# Altium project esp32_motor_driver.PrjPcb
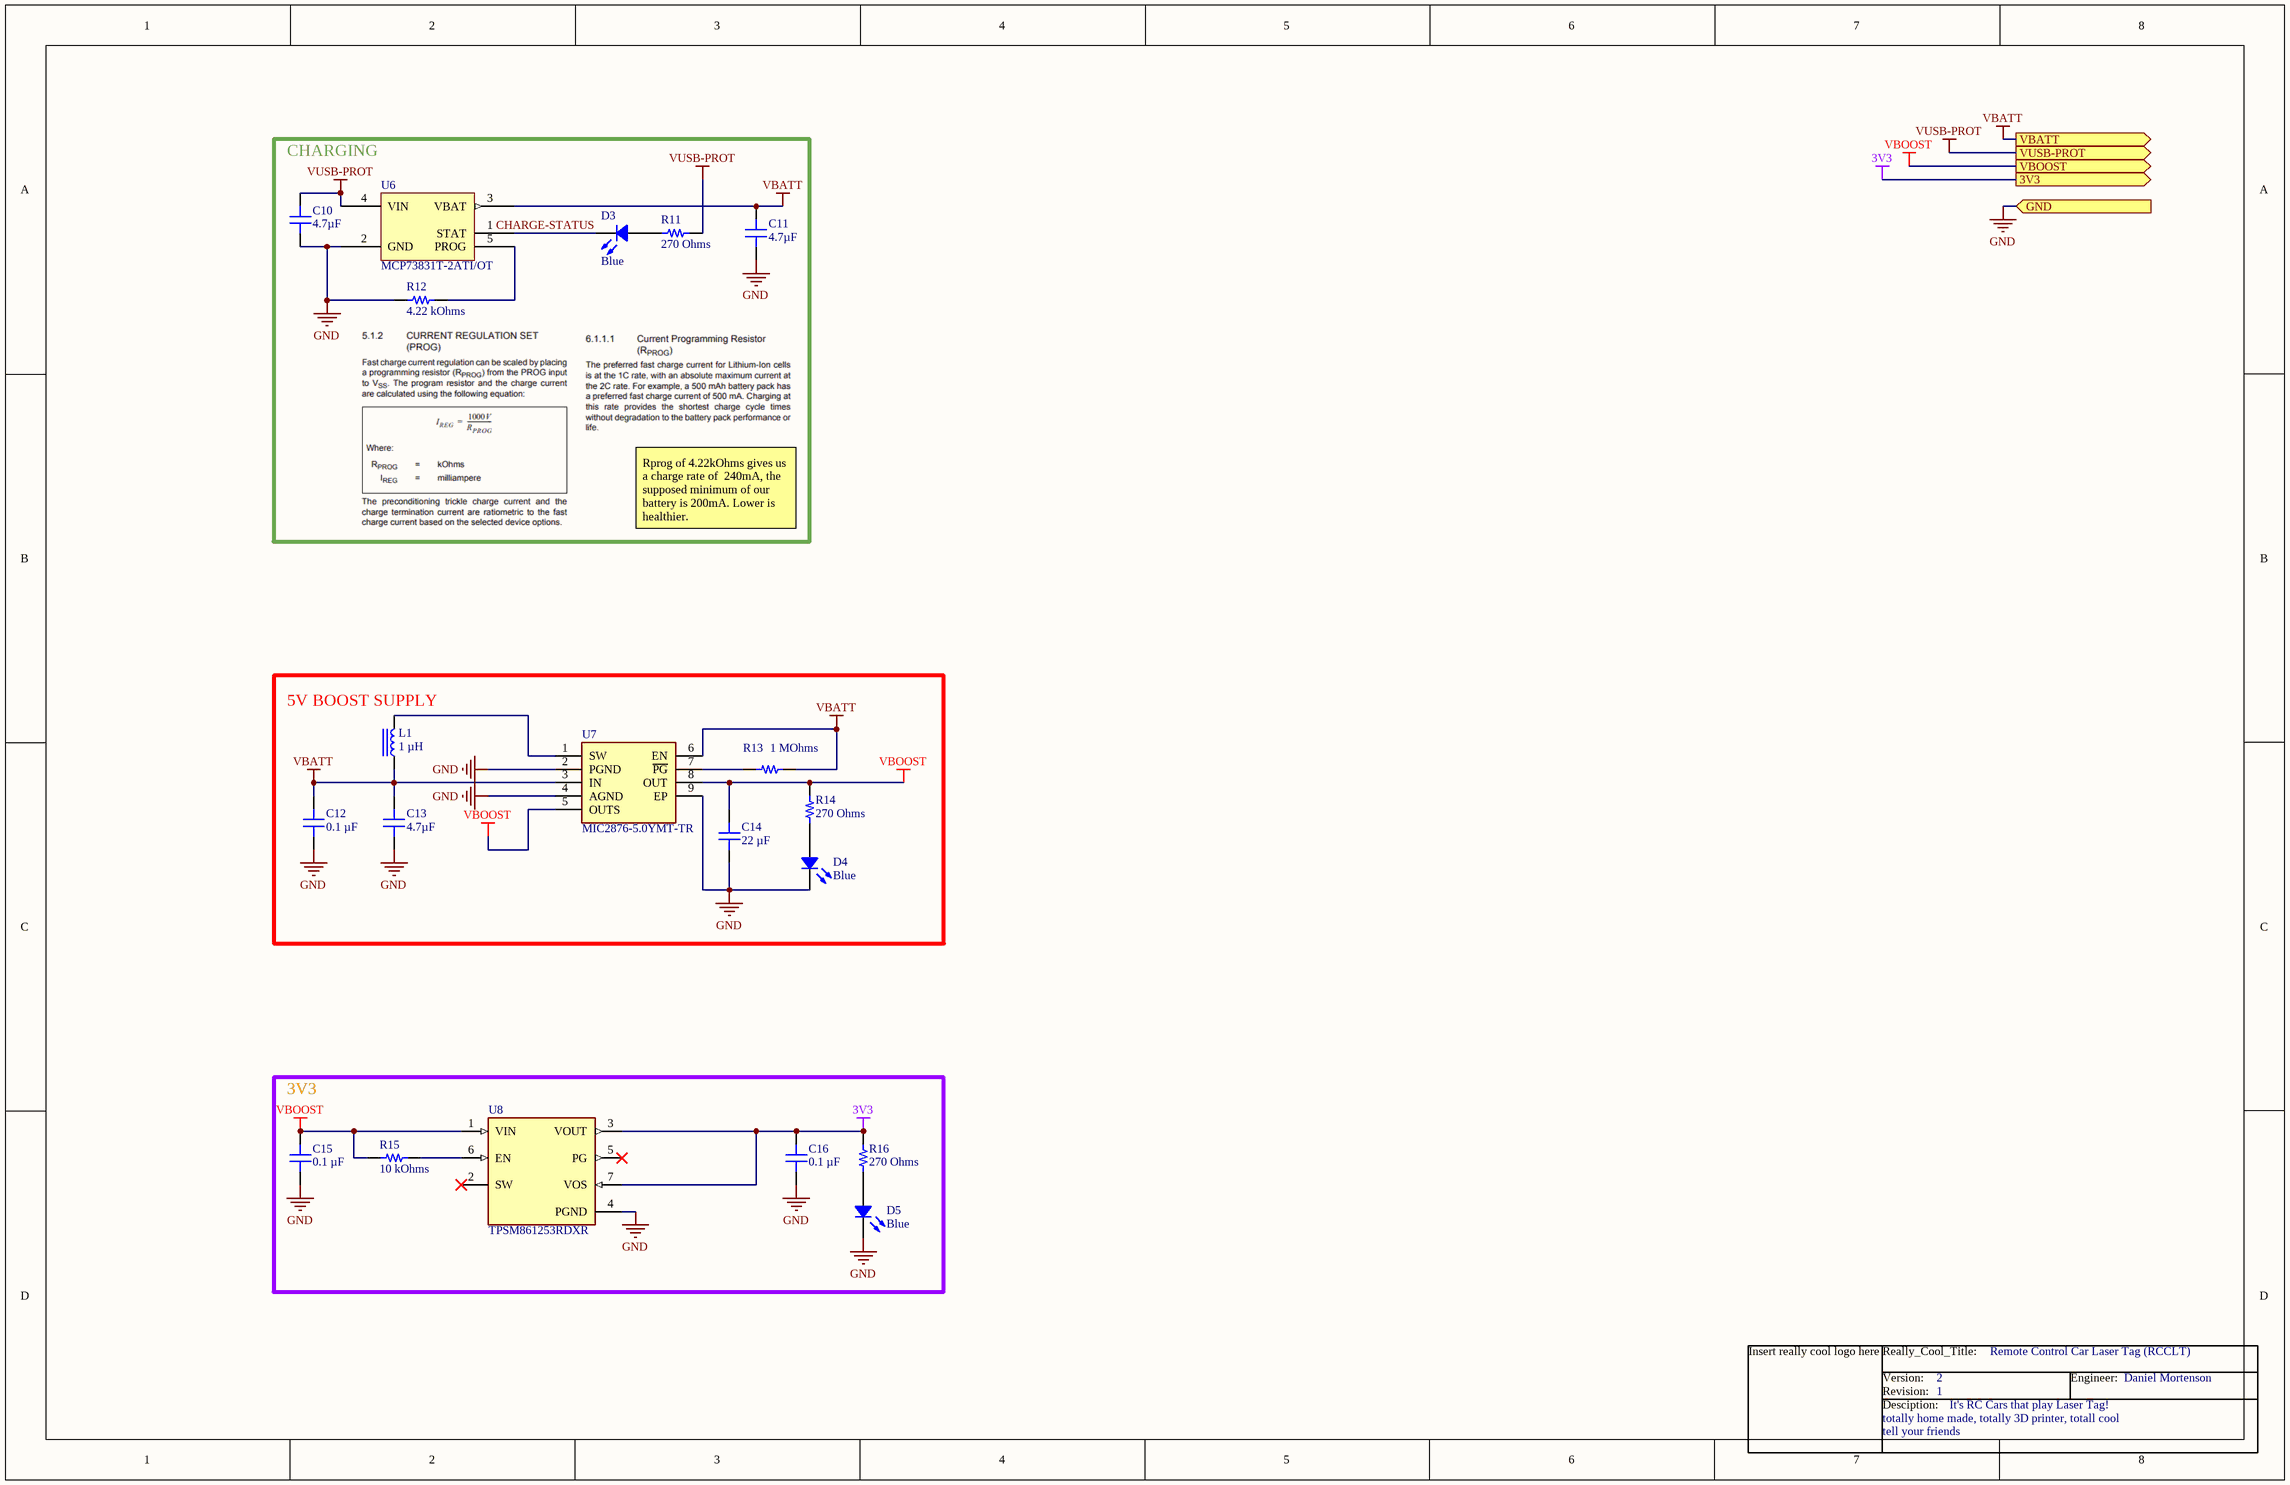
[diagram p0: Power_Supply.SchDoc]
Description1: It's RC Cars that play Laser Tag!; Description2: totally home made, totally 3D printer, totall cool; Description3: tell your friends; Engineer: Daniel Mortenson; Really_Cool_Title: Remote Control Car Laser Tag (RCCLT); Revision: 1; Version: 2
1 sheet, 20 parts. Net scope: flat (ports and power ports of the same name join across sheets).
Board file: RCCLTV2.PcbDoc

## Sheet Power_Supply.SchDoc
size Tabloid; SheetNumber: 3; SheetTotal: 4

### Parts
C10  4.7µF  [CAP 0805_2012]
C11  4.7µF  [CAP 0805_2012]
C12  0.1 µF  [CAP 0805_2012]
C13  4.7µF  [CAP 0805_2012]
C14  22 µF  [CAP 0805_2012]
C15  0.1 µF  [CAP 0805_2012]
C16  0.1 µF  [CAP 0805_2012]
D3  Blue  [LED 0805_2012 BLUE]
D4  Blue  [LED 0805_2012 BLUE]
D5  Blue  [LED 0805_2012 BLUE]
L1  1 µH  [TAIYO YUDEN MAMK2520T1R0M]
R11  270 Ohms  [RES 0805_2012]
R12  4.22 kOhms  [RES 0805_2012]
R13  1 MOhms  [RES 0805_2012]
R14  270 Ohms  [RES 0805_2012]
R15  10 kOhms  [RES 0805_2012]
R16  270 Ohms  [RES 0805_2012]
U6  MCP73831T-2ATI/OT  [MICROCHIP SOT-23-5 OT]
U7  MIC2876-5.0YMT-TR  [MIC287650YMTTR]
U8  TPSM861253RDXR  [VREG_TPSM861253RDXR]

### Blocks framed on the sheet
CHARGING: C10 C11 D3 R11 R12 U6
5V BOOST SUPPLY: C12-C14 D4 L1 R13 R14 U7
3V3: C15 C16 D5 R15 R16 U8

### Ports
3V3 (out), GND (in), VBATT (out), VBOOST (out), VUSB-PROT (out)

### Nets
3V3: C16.2 R16.1 U8.3(VOUT) U8.7(VOS) ; port 3V3
GND: C10.2 C11.2 C12.1 C13.1 C14.1 C15.1 C16.1 D4.2 D5.2 R12.1 U6.2(GND) U7.2(PGND) U7.4(AGND) U7.9(EP) U8.4(PGND) ; port GND
VBATT: C11.1 C12.2 C13.2 L1.1 R13.2 U6.3(VBAT) U7.3(IN) U7.6(EN) ; port VBATT
VBOOST: C14.2 C15.2 R14.1 R15.2 U7.5(OUTS) U7.8(OUT) U8.1(VIN) ; port VBOOST
VUSB-PROT: C10.1 R11.1 U6.4(VIN) ; port VUSB-PROT
CHARGE-STATUS: D3.2 U6.1(STAT)
NetD3_1: D3.1 R11.2
NetD4_1: D4.1 R14.2
NetD5_1: D5.1 R16.2
NetL1_2: L1.2 U7.1(SW)
NetR12_2: R12.2 U6.5(PROG)
NetR13_1: R13.1 U7.7(~{PG})
NetR15_1: R15.1 U8.6(EN)

Not connected (* = marked no-connect by the designer): U8 2(SW)* 5(PG)*

### Notes on the sheet
- Rprog of 4.22kOhms gives us a charge rate of  240mA, the supposed minimum of our battery is 200mA. Lower is healthier.
- Insert really cool logo here
- Really_Cool_Title:
- Revision:
- Desciption:
- Version:
- Engineer:

### Library data of the parts
C10 C11 C13 = 0805YC475KAT2A: CAP CER 4.7UF 16V X7R 0805; manufacturer: AVX Corporation; Tolerance: ±10%; Part Number: 0805YC475KAT2A; Capacitance: 4.7µF; Applications: General Purpose; componentlink1description: Datasheet; componentlink1url: http://datasheets.avx.com/X7RDielectric.pdf; componentlink2description: DigiKey Link; componentlink2url: http://digikey.com/product-detail/en/avx-corporation/0805YC475KAT2A/478-5722-1-ND/2136330; Device Package: 0805 (2012 Metric); lastupdated: 9/2/2020 1:04:38 AM; Lifecycle Status: Active; Minimum Order: 1; Mounting Type: Surface Mount, MLCC; Operating Temperature: -55°C ~ 125°C; Package / Case: 0805 (2012 Metric); packaging: TapeAndReel; partid: 4831; Part Status: Active; price: 0.11; series: -; Size / Dimension: 0.079" L x 0.049" W (2.01mm x 1.25mm); Supplier 1: DigiKey; Supplier Part Number 1: 478-5722-1-ND; Temperature Coefficient: X7R; Thickness (Max): 0.060" (1.52mm); value: 4.7µF; Voltage - Rated: 16V
C12 C15 C16 = 0805B104K250CT: CAP CER 0.1UF 25V X7R 0805; manufacturer: Walsin Technology Corporation; Tolerance: ±10%; Part Number: 0805B104K250CT; Capacitance: 0.1 µF; Applications: General Purpose; componentlink1description: Datasheet; componentlink1url: http://www.passivecomponent.com/wp-content/uploads/2018/10/MLCC.pdf; componentlink2description: DigiKey Link; componentlink2url: https://www.digikey.com/en/products/detail/walsin-technology-corporation/0805B104K250CT/9355063; Device Package: 0805 (2012 Metric); lastupdated: 2/9/2024 8:16:02 PM; Lifecycle Status: Active; Minimum Order: 1; Mounting Type: Surface Mount, MLCC; Operating Temperature: -55°C ~ 125°C; Package / Case: 0805 (2012 Metric); packaging: TapeAndReel; partid: 4879; Part Status: Active; price: 0.01; series: -; Size / Dimension: 0.079" L x 0.049" W (2.00mm x 1.25mm); Supplier 1: DigiKey; Supplier Part Number 1: 1292-1566-1-ND; Temperature Coefficient: X7R; Thickness (Max): 0.035" (0.90mm); value: 0.1 µF; Voltage - Rated: 25V
C14 = CL21A226KQQNNNE: CAP CER 22UF 6.3V X5R 0805; manufacturer: Samsung Electro-Mechanics; Tolerance: ±10%; Part Number: CL21A226KQQNNNE; Capacitance: 22 µF; Applications: General Purpose; componentlink1description: Datasheet; componentlink1url: http://www.samsungsem.com/kr/support/product-search/mlcc/CL21A226KQQNNNE.jsp; componentlink2description: DigiKey Link; componentlink2url: https://www.digikey.com/en/products/detail/samsung-electro-mechanics/CL21A226KQQNNNE/3888565; Device Package: 0805 (2012 Metric); lastupdated: 2/9/2024 8:16:07 PM; Lifecycle Status: Active; Minimum Order: 1; Mounting Type: Surface Mount, MLCC; Operating Temperature: -55°C ~ 85°C; Package / Case: 0805 (2012 Metric); packaging: TapeAndReel; partid: 3051; Part Status: Active; price: 0.03; series: CL; Size / Dimension: 0.079" L x 0.049" W (2.00mm x 1.25mm); Supplier 1: DigiKey; Supplier Part Number 1: 1276-2907-1-ND; Temperature Coefficient: X5R; Thickness (Max): 0.055" (1.40mm); value: 22 µF; Voltage - Rated: 6.3V
D3-D5 = 150080BS75000: LED BLUE CLEAR 0805 SMD; Manufacturer: Würth Elektronik; Configuration: Standard; Current - Test: 20mA; Lens Color: Colorless; Lens Size: 1.40mm x 1.25mm; Lens Style: Rectangle with Flat Top; Millicandela Rating: 145mcd; Viewing Angle: 140°; Voltage - Forward (Vf) (Typ): 3.2V; Wavelength - Dominant: 470nm; Wavelength - Peak: 465nm; Part Number: 150080BS75000; Color: Blue; ComponentLink1Description: Datasheet; ComponentLink1URL: https://katalog.we-online.de/led/datasheet/150080BS75000.pdf; ComponentLink2Description: DigiKey Link; ComponentLink2URL: https://www.digikey.com/en/products/detail/würth-elektronik/150080BS75000/4489912; Device Package: 0805 (2012 Metric); Height (Max): 0.80mm; LastUpdated: 6/3/2024 7:58:01 PM; Lens Transparency: Clear; Lifecycle Status: Active; Minimum Order: 1; Mounting Type: Surface Mount; Package / Case: 0805 (2012 Metric); Packaging: TapeAndReel; PartId: 779; Part Status: Active; Price: 0.13; Series: WL-SMCW; Size / Dimension: 2.00mm L x 1.25mm W; Supplier 1: DigiKey; Supplier Part Number 1: 732-4982-1-ND; Supplier Device Package: 0805; Value: Blue
L1 = MAMK2520T1R0M: FIXED IND 1UH 2.7A 59 MOHM SMD; Manufacturer: Taiyo Yuden; Current - Saturation: 3.1A; DC Resistance (DCR): 59mOhm Max; Inductance Frequency - Test: 2 MHz; Material - Core: Metal; Shielding: Shielded; Tolerance: ±20%; Type: Drum Core, Wirewound; Part Number: MAMK2520T1R0M; ComponentLink1Description: Datasheet; ComponentLink1URL: https://ds.yuden.co.jp/TYCOMPAS/ut/detail?pn=MAMK2520T1R0M  &u=M; ComponentLink2Description: DigiKey Link; ComponentLink2URL: https://www.digikey.com/en/products/detail/taiyo-yuden/MAMK2520T1R0M/3479448; Current Rating (Amps): 2.7 A; Device Package: 1008 (2520 Metric); Height - Seated (Max): 0.047" (1.20mm); Inductance: 1 µH; LastUpdated: 6/3/2024 8:02:39 PM; Lifecycle Status: Active; Minimum Order: 1; Mounting Type: Surface Mount; Operating Temperature: -40°C ~ 105°C; Package / Case: 1008 (2520 Metric); Packaging: TapeAndReel; PartId: 70; Part Status: Active; Price: 0.07; Series: MCOIL™, MA; Size / Dimension: 0.098" L x 0.079" W (2.50mm x 2.00mm); Supplier 1: DigiKey; Supplier Part Number 1: 587-3225-1-ND; Supplier Device Package: 1008 (2520 Metric); Value: 1 µH
R11 R14 R16 = CRG0805F270R: RES SMD 270 OHM 1% 1/8W 0805; Manufacturer: TE Connectivity Passive Product; Power (Watts): 0.125W, 1/8W; Temperature Coefficient: ±100ppm/°C; Part Number: CRG0805F270R; Value: 270 Ohms; ComponentLink1Description: Datasheet; ComponentLink1URL: https://www.te.com/commerce/DocumentDelivery/DDEController?Action=srchrtrv&DocNm=1773204&DocType=DS&DocLang=English; ComponentLink2Description: DigiKey Link; ComponentLink2URL: https://www.digikey.com/en/products/detail/te-connectivity-passive-product/CRG0805F270R/2380878; Composition: Thick Film; Device Package: 0805 (2012 Metric); Height - Seated (Max): 0.026" (0.65mm); LastUpdated: 2/8/2024 9:02:34 PM; Lifecycle Status: Active; Minimum Order: 1; Number of Terminations: 2; Operating Temperature: -55°C ~ 155°C; Package / Case: 0805 (2012 Metric); Packaging: TapeAndReel; PartId: 28942; Part Status: Active; Price: 0.01; Resistance: 270 Ohms; Series: CRG, Neohm; Size / Dimension: 0.079" L x 0.049" W (2.00mm x 1.25mm); Supplier 1: DigiKey; Supplier Part Number 1: A126355CT-ND; Supplier Device Package: 0805; Tolerance: ±1%
R12 = ERA-6AEB4221V: RES SMD 4.22K OHM 0.1% 1/8W 0805; Manufacturer: Panasonic Electronic Components; Power (Watts): 0.125W, 1/8W; Temperature Coefficient: ±25ppm/°C; Part Number: ERA-6AEB4221V; Value: 4.22 kOhms; ComponentLink1Description: Datasheet; ComponentLink1URL: https://industrial.panasonic.com/cdbs/www-data/pdf/RDM0000/AOA0000C307.pdf; ComponentLink2Description: DigiKey Link; ComponentLink2URL: https://www.digikey.com/en/products/detail/panasonic-electronic-components/ERA-6AEB4221V/2025719; Composition: Thin Film; Device Package: 0805 (2012 Metric); Features: Automotive AEC-Q200; Height - Seated (Max): 0.024" (0.60mm); LastUpdated: 2/8/2024 9:02:36 PM; Lifecycle Status: Active; Minimum Order: 1; Number of Terminations: 2; Operating Temperature: -55°C ~ 155°C; Package / Case: 0805 (2012 Metric); Packaging: TapeAndReel; PartId: 28375; Part Status: Active; Price: 0.03; Ratings: AEC-Q200; Resistance: 4.22 kOhms; Series: ERA-6A; Size / Dimension: 0.079" L x 0.049" W (2.00mm x 1.25mm); Supplier 1: DigiKey; Supplier Part Number 1: P4.22KDACT-ND; Supplier Device Package: 0805; Tolerance: ±0.1%
R13 = ERA-6AEB105V: RES 1M OHM 0.1% 1/8W 0805; Manufacturer: Panasonic Electronic Components; Power (Watts): 0.125W, 1/8W; Temperature Coefficient: ±25ppm/°C; Part Number: ERA-6AEB105V; Value: 1 MOhms; ComponentLink1Description: Datasheet; ComponentLink1URL: https://industrial.panasonic.com/cdbs/www-data/pdf/RDM0000/AOA0000C307.pdf; ComponentLink2Description: DigiKey Link; ComponentLink2URL: https://www.digikey.com/en/products/detail/panasonic-electronic-components/ERA-6AEB105V/1465821; Composition: Thin Film; Device Package: 0805 (2012 Metric); Features: Automotive AEC-Q200; Height - Seated (Max): 0.024" (0.60mm); LastUpdated: 7/13/2023 7:38:53 PM; Lifecycle Status: Active; Minimum Order: 1; Number of Terminations: 2; Operating Temperature: -55°C ~ 155°C; Package / Case: 0805 (2012 Metric); Packaging: TapeAndReel; PartId: 28069; Part Status: Active; Price: 0.03; Ratings: AEC-Q200; Resistance: 1 MOhms; Series: ERA-6A; Size / Dimension: 0.079" L x 0.049" W (2.00mm x 1.25mm); Supplier 1: DigiKey; Supplier Part Number 1: P1MDACT-ND; Supplier Device Package: 0805; Tolerance: ±0.1%
R15 = CRCW080510K0FKEA: RES SMD 10K OHM 1% 1/8W 0805; Manufacturer: Vishay Dale; Power (Watts): 0.125W, 1/8W; Temperature Coefficient: ±100ppm/°C; Part Number: CRCW080510K0FKEA; Value: 10 kOhms; ComponentLink1Description: Datasheet; ComponentLink1URL: http://www.vishay.com/docs/20035/dcrcwe3.pdf; ComponentLink2Description: DigiKey Link; ComponentLink2URL: https://www.digikey.com/en/products/detail/vishay-dale/CRCW080510K0FKEA/1175751; Composition: Thick Film; Device Package: 0805 (2012 Metric); Features: Automotive AEC-Q200; Height - Seated (Max): 0.020" (0.50mm); LastUpdated: 2/8/2024 9:02:37 PM; Lifecycle Status: Active; Minimum Order: 1; Number of Terminations: 2; Operating Temperature: -55°C ~ 155°C; Package / Case: 0805 (2012 Metric); Packaging: TapeAndReel; PartId: 28101; Part Status: Active; Price: 0.01; Ratings: AEC-Q200; Resistance: 10 kOhms; Series: CRCW; Size / Dimension: 0.079" L x 0.049" W (2.00mm x 1.25mm); Supplier 1: DigiKey; Supplier Part Number 1: 541-10.0KCCT-ND; Supplier Device Package: 0805; Tolerance: ±1%
U6 = MCP73831T-2ATI/OT: IC CONTROLLR LI-ION 4.2V SOT23-5; Manufacturer: Microchip Technology; Battery Chemistry: Lithium Ion/Polymer; Charge Current - Max: 500mA; Current - Charging: Constant - Programmable; Fault Protection: Over Voltage; Number of Cells: 1; Programmable Features: Current; Voltage - Supply (Max): 6V; Part Number: MCP73831T-2ATI/OT; Battery Pack Voltage: 4.2V; ComponentLink1Description: Datasheet; ComponentLink1URL: http://ww1.microchip.com/downloads/en/DeviceDoc/20001984g.pdf; ComponentLink2Description: DigiKey Link; ComponentLink2URL: //digikey.com/product-detail/en/microchip-technology/MCP73831T-2ATI-OT/MCP73831T-2ATI-OTTR-ND/964303; Device Package: SC-74A, SOT-753; LastUpdated: 12/3/2019 11:33:03 PM; Lifecycle Status: 0; Minimum Order: 1; Mounting Type: Surface Mount; Operating Temperature: -40°C ~ 85°C (TA); Package / Case: SC-74A, SOT-753; Packaging: TapeAndReel; PartId: 1; Part Status: Active; Price: 0.42; Series: -; Supplier 1: DigiKey; Supplier Part Number 1: MCP73831T-2ATI/OTTR-ND; Supplier Device Package: SOT-23-5
U7 = MIC2876-5.0YMT-TR: Integrated Circuit; Manufacturer_Name: Microchip; Datasheet Link: https://componentsearchengine.com/Datasheets/1/MIC2876-5.0YMT-TR.pdf; Height: 0.6mm; Manufacturer_Part_Number: MIC2876-5.0YMT-TR; Mouser Part Number: 998-MIC2876-50YMTTR; Mouser Price/Stock: https://www.mouser.co.uk/ProductDetail/Microchip-Technology/MIC2876-5.0YMT-TR?qs=Y3Q3JoKAO1ROB46ffRMt%252BQ%3D%3D; Arrow Part Number: MIC2876-5.0YMT-TR; Arrow Price/Stock: https://www.arrow.com/en/products/mic2876-5.0ymt-tr/microchip-technology?region=nac
U8 = TPSM861253RDXR: 3V to 17V input voltage, 3.3V, 1A output synchronous buck module in QFN package; MF: Texas Instruments; SnapEDA_Link: https://www.snapeda.com/parts/TPSM861253RDXR/Texas+Instruments/view-part/?ref=snap; Package: PowerFQFN-7 Texas Instruments; Value: *; MP: TPSM861253RDXR; Check_prices: https://www.snapeda.com/parts/TPSM861253RDXR/Texas+Instruments/view-part/?ref=eda